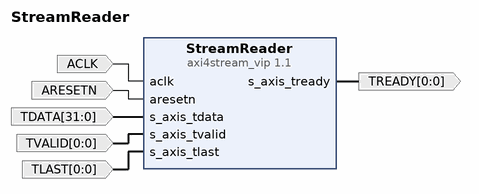
[diagram p0: block diagram of the top level]
# Vivado block design StreamReader, xc7z010clg400-1, Vivado 2019.2
create_bd_design StreamReader

create_bd_port -dir I -from 31 -to 0 TDATA
create_bd_port -dir O -from 0 -to 0 TREADY
create_bd_port -dir I -from 0 -to 0 TLAST
create_bd_port -dir I -type clk ACLK
set_property -dict {CONFIG.FREQ_HZ 125000000} [get_bd_ports ACLK]
create_bd_port -dir I -from 0 -to 0 TVALID
create_bd_port -dir I -type rst ARESETN

create_bd_cell -type ip -vlnv xilinx.com:ip:axi4stream_vip:1.1 StreamReader
set_property -dict {CONFIG.INTERFACE_MODE SLAVE CONFIG.TDATA_NUM_BYTES 4} [get_bd_cells StreamReader]

# ---- connections ----

connect_bd_net -net aclk_0_1 [get_bd_ports ACLK] [get_bd_pins StreamReader/aclk]
connect_bd_net -net aresetn_0_1 [get_bd_ports ARESETN] [get_bd_pins StreamReader/aresetn]
connect_bd_net [get_bd_ports TDATA] [get_bd_pins StreamReader/s_axis_tdata]
connect_bd_net [get_bd_ports TVALID] [get_bd_pins StreamReader/s_axis_tvalid]
connect_bd_net [get_bd_pins StreamReader/s_axis_tready] [get_bd_ports TREADY]
connect_bd_net [get_bd_ports TLAST] [get_bd_pins StreamReader/s_axis_tlast]

validate_bd_design
save_bd_design
